# EAGLE design YAKS2-TITUO.R03.1bl (EAGLE 9.2.0)
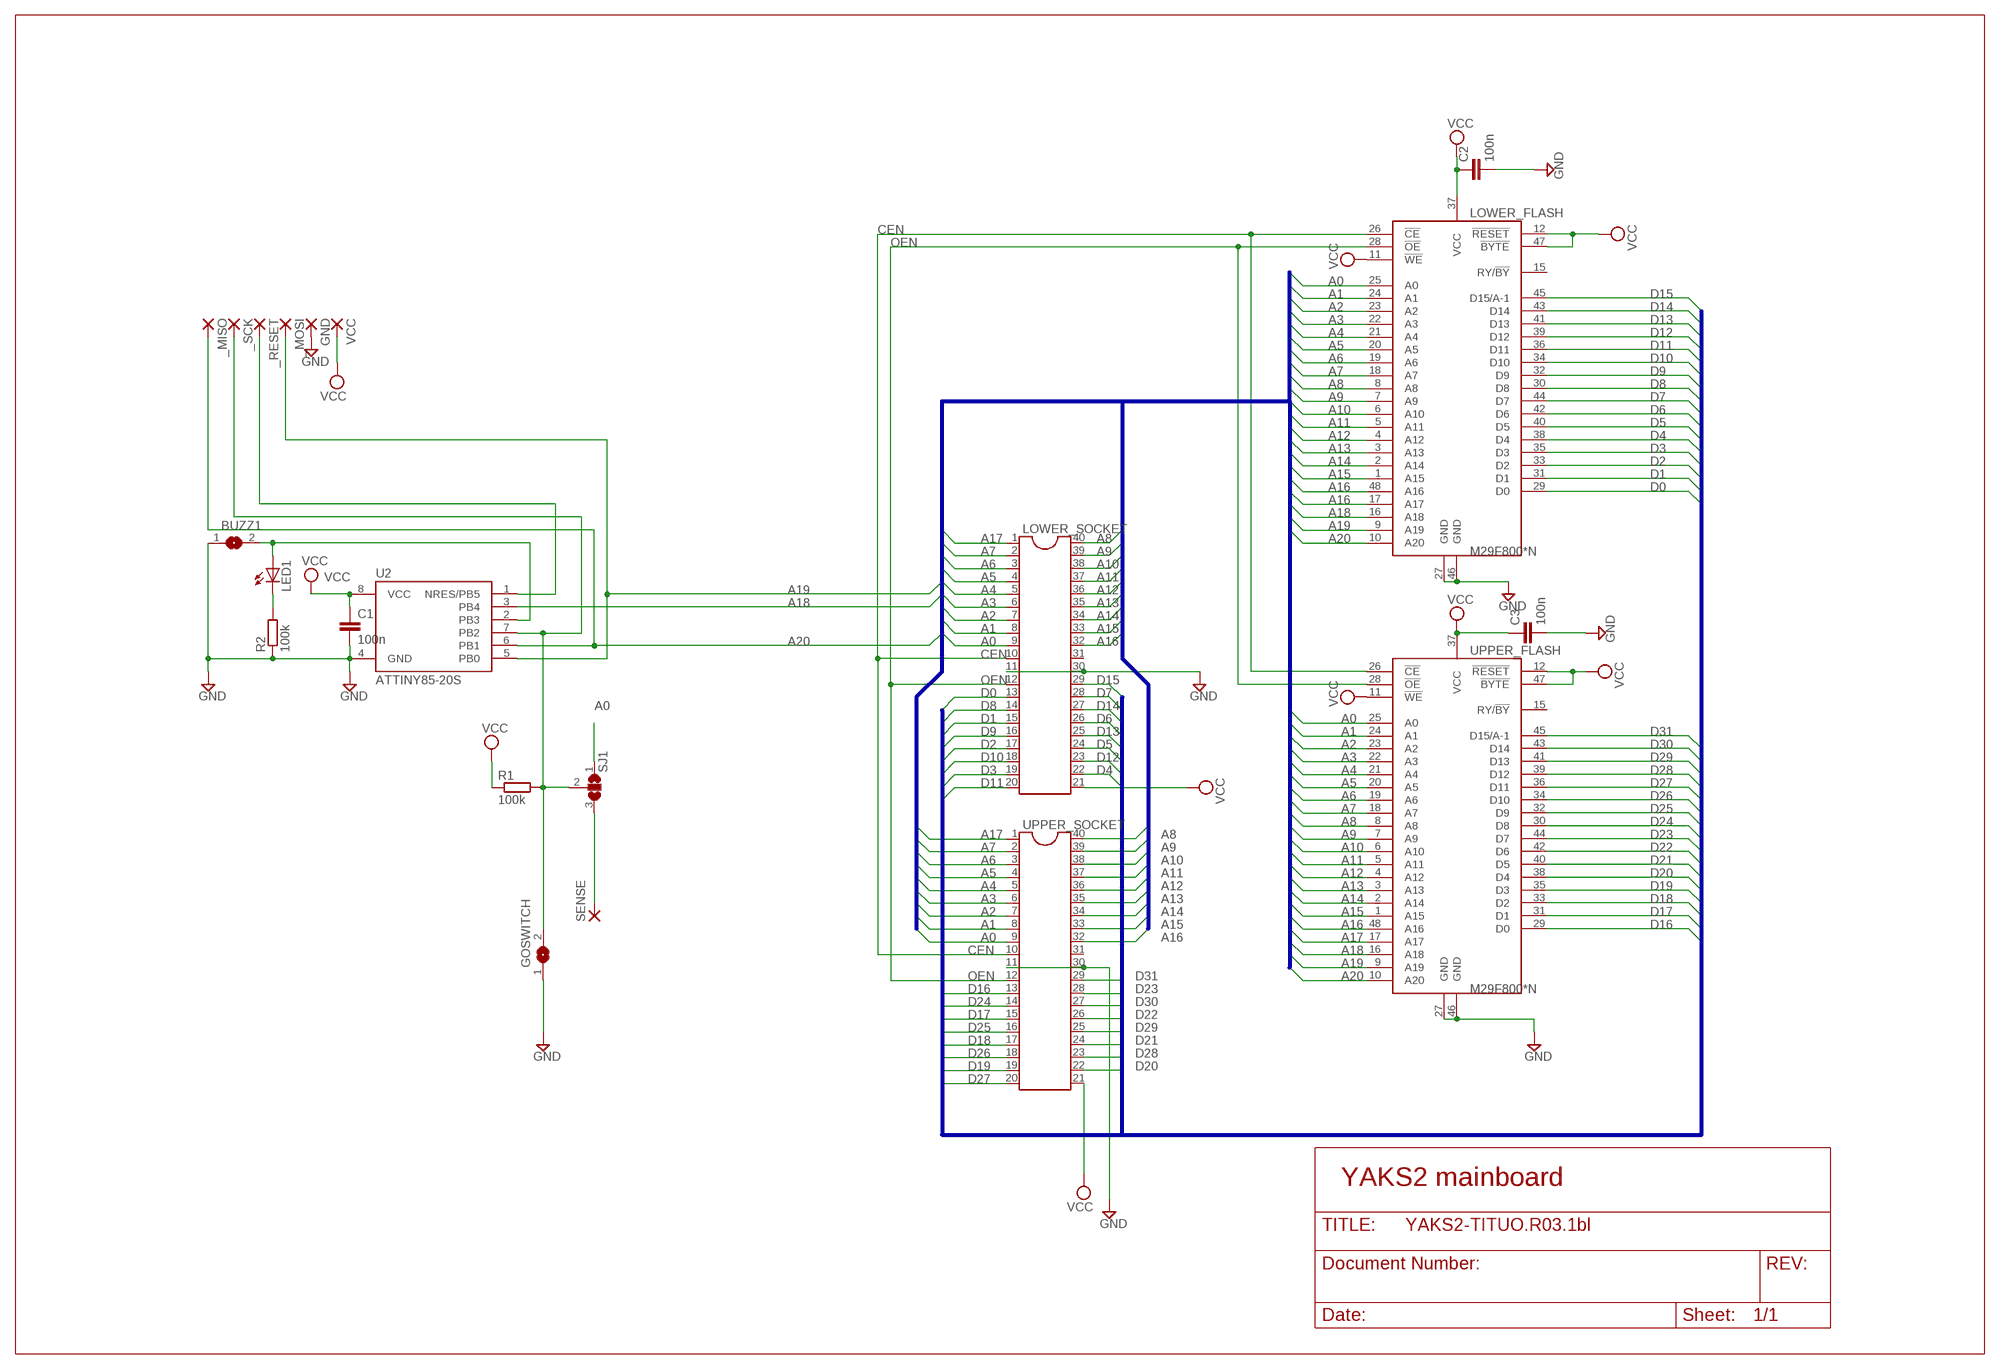
[diagram p0: schematic, sheet 1]

## Parts
_MISO  SMD2  [SMD1,27-2,54]
_MOSI  SMD2  [SMD1,27-2,54]
_RESET  SMD2  [SMD1,27-2,54]
_SCK  SMD2  [SMD1,27-2,54]
BUZZ1  SJ  [SJ]
C1  100n  C-EUC0805  [C0805]
C2  100n  C-EUC0805  [C0805]
C3  100n  C-EUC0805  [C0805]
GND  SMD2  [SMD1,27-2,54]
GOSWITCH  SJ  [SJ]
LED1  LEDSML0805  [SML0805]
LOWER_FLASH  M29F800*N  [48-TSOP]
LOWER_SOCKET  DIL40DIL40SMALLPIN  [DIL40SMALLPIN]
R1  100k  R-EU_M0805  [M0805]
R2  100k  R-EU_M0805  [M0805]
SENSE  SMD2  [SMD1,27-2,54]
SJ1  SJ2W  [SJ_2]
U2  ATTINY85-20S  [SOIC8_EIAJ_208MIL]
UPPER_FLASH  M29F800*N  [48-TSOP]
UPPER_SOCKET  DIL40DIL40SMALLPIN  [DIL40SMALLPIN]
VCC  SMD2  [SMD1,27-2,54]

## Nets
A0: LOWER_FLASH.25(A0) LOWER_SOCKET.9 SJ1.1 UPPER_FLASH.25(A0) UPPER_SOCKET.9
A1: LOWER_FLASH.24(A1) LOWER_SOCKET.8 UPPER_FLASH.24(A1) UPPER_SOCKET.8
A2: LOWER_FLASH.23(A2) LOWER_SOCKET.7 UPPER_FLASH.23(A2) UPPER_SOCKET.7
A3: LOWER_FLASH.22(A3) LOWER_SOCKET.6 UPPER_FLASH.22(A3) UPPER_SOCKET.6
A4: LOWER_FLASH.21(A4) LOWER_SOCKET.5 UPPER_FLASH.21(A4) UPPER_SOCKET.5
A5: LOWER_FLASH.20(A5) LOWER_SOCKET.4 UPPER_FLASH.20(A5) UPPER_SOCKET.4
A6: LOWER_FLASH.19(A6) LOWER_SOCKET.3 UPPER_FLASH.19(A6) UPPER_SOCKET.3
A7: LOWER_FLASH.18(A7) LOWER_SOCKET.2 UPPER_FLASH.18(A7) UPPER_SOCKET.2
A8: LOWER_FLASH.8(A8) LOWER_SOCKET.40 UPPER_FLASH.8(A8) UPPER_SOCKET.40
A9: LOWER_FLASH.7(A9) LOWER_SOCKET.39 UPPER_FLASH.7(A9) UPPER_SOCKET.39
A10: LOWER_FLASH.6(A10) LOWER_SOCKET.38 UPPER_FLASH.6(A10) UPPER_SOCKET.38
A11: LOWER_FLASH.5(A11) LOWER_SOCKET.37 UPPER_FLASH.5(A11) UPPER_SOCKET.37
A12: LOWER_FLASH.4(A12) LOWER_SOCKET.36 UPPER_FLASH.4(A12) UPPER_SOCKET.36
A13: LOWER_FLASH.3(A13) LOWER_SOCKET.35 UPPER_FLASH.3(A13) UPPER_SOCKET.35
A14: LOWER_FLASH.2(A14) LOWER_SOCKET.34 UPPER_FLASH.2(A14) UPPER_SOCKET.34
A15: LOWER_FLASH.1(A15) LOWER_SOCKET.33 UPPER_FLASH.1(A15) UPPER_SOCKET.33
A16: LOWER_FLASH.48(A16) LOWER_SOCKET.32 UPPER_FLASH.48(A16) UPPER_SOCKET.32
A17: LOWER_FLASH.17(A17) LOWER_SOCKET.1 UPPER_FLASH.17(A17) UPPER_SOCKET.1
A18: LOWER_FLASH.16(A18) U2.3(PB4) UPPER_FLASH.16(A18)
A19: _MOSI.1(P) LOWER_FLASH.9(A19) U2.5(PB0) UPPER_FLASH.9(A19)
A20: _MISO.1(P) LOWER_FLASH.10(A20) U2.6(PB1) UPPER_FLASH.10(A20)
BUZZ1: BUZZ1.2 LED1.A U2.2(PB3)
CEN: LOWER_FLASH.26(!CE) LOWER_SOCKET.10 UPPER_FLASH.26(!CE) UPPER_SOCKET.10
D0: LOWER_FLASH.29(D0) LOWER_SOCKET.13
D1: LOWER_FLASH.31(D1) LOWER_SOCKET.15
D2: LOWER_FLASH.33(D2) LOWER_SOCKET.17
D3: LOWER_FLASH.35(D3) LOWER_SOCKET.19
D4: LOWER_FLASH.38(D4) LOWER_SOCKET.22
D5: LOWER_FLASH.40(D5) LOWER_SOCKET.24
D6: LOWER_FLASH.42(D6) LOWER_SOCKET.26
D7: LOWER_FLASH.44(D7) LOWER_SOCKET.28
D8: LOWER_FLASH.30(D8) LOWER_SOCKET.14
D9: LOWER_FLASH.32(D9) LOWER_SOCKET.16
D10: LOWER_FLASH.34(D10) LOWER_SOCKET.18
D11: LOWER_FLASH.36(D11) LOWER_SOCKET.20
D12: LOWER_FLASH.39(D12) LOWER_SOCKET.23
D13: LOWER_FLASH.41(D13) LOWER_SOCKET.25
D14: LOWER_FLASH.43(D14) LOWER_SOCKET.27
D15: LOWER_FLASH.45(D15/A-1) LOWER_SOCKET.29
D16: UPPER_FLASH.29(D0) UPPER_SOCKET.13
D17: UPPER_FLASH.31(D1) UPPER_SOCKET.15
D18: UPPER_FLASH.33(D2) UPPER_SOCKET.17
D19: UPPER_FLASH.35(D3) UPPER_SOCKET.19
D20: UPPER_FLASH.38(D4) UPPER_SOCKET.22
D21: UPPER_FLASH.40(D5) UPPER_SOCKET.24
D22: UPPER_FLASH.42(D6) UPPER_SOCKET.26
D23: UPPER_FLASH.44(D7) UPPER_SOCKET.28
D24: UPPER_FLASH.30(D8) UPPER_SOCKET.14
D25: UPPER_FLASH.32(D9) UPPER_SOCKET.16
D26: UPPER_FLASH.34(D10) UPPER_SOCKET.18
D27: UPPER_FLASH.36(D11) UPPER_SOCKET.20
D28: UPPER_FLASH.39(D12) UPPER_SOCKET.23
D29: UPPER_FLASH.41(D13) UPPER_SOCKET.25
D30: UPPER_FLASH.43(D14) UPPER_SOCKET.27
D31: UPPER_FLASH.45(D15/A-1) UPPER_SOCKET.29
GND: BUZZ1.1 C1.2 C2.2 C3.2 GND.1(P) GOSWITCH.1 LOWER_FLASH.27(GND) LOWER_FLASH.46(GND) LOWER_SOCKET.11 LOWER_SOCKET.30 R2.1 U2.4(GND) UPPER_FLASH.27(GND) UPPER_FLASH.46(GND) UPPER_SOCKET.11 UPPER_SOCKET.30
N$1: LED1.C R2.2
N$4: _RESET.1(P) U2.1(NRES/PB5)
N$8: SENSE.1(P) SJ1.3
OEN: LOWER_FLASH.28(!OE) LOWER_SOCKET.12 UPPER_FLASH.28(!OE) UPPER_SOCKET.12
SCK/PB2: _SCK.1(P) GOSWITCH.2 R1.2 SJ1.2 U2.7(PB2)
VCC: C1.1 C2.1 C3.1 LOWER_FLASH.11(!WE) LOWER_FLASH.12(!RESET) LOWER_FLASH.37(VCC) LOWER_FLASH.47(!BYTE) LOWER_SOCKET.21 R1.1 U2.8(VCC) UPPER_FLASH.11(!WE) UPPER_FLASH.12(!RESET) UPPER_FLASH.37(VCC) UPPER_FLASH.47(!BYTE) UPPER_SOCKET.21 VCC.1(P)
Unconnected: LOWER_FLASH.15(RY/!BY) LOWER_SOCKET.31 UPPER_FLASH.15(RY/!BY) UPPER_SOCKET.31

## Buses
A[0..20]
D[0..31]

## Notes on the sheet
- YAKS2 mainboard

## Library data of the parts
_MISO _MOSI _RESET _SCK GND SENSE VCC = wirepad:SMD2: SMD PAD
BUZZ1 GOSWITCH = jumper:SJ: SMD solder JUMPER
C1-C3 = resistor:C-EU: CAPACITOR, European symbol
LED1 = led:LED: LED OSRAM: - CHIPLED LG R971, LG N971, LY N971, LG Q971, LY Q971, LO R971, LY R971 LH N974, LH R974 LS Q976, LO Q976, LY Q976 LO Q996 - Hyper CHIPLED LW Q18S LB Q993, LB Q99A, LB R99A - SideLED LS A670, LO A670, LY A670, LG A670, LP A670 LB A673, LV A673, LT A673, LW A673 LH A674 LY A675 LS A676, LA A676, LO A676, LY A676, LW A676 LS A679, LY A679, LG A679 - Hyper Micro SIDELED® LS Y876, LA Y876, LO Y876, LY Y876 LT Y87S - SmartLED LW L88C, LW L88S LB L89C, LB L89S, LG L890 LS L89K, LO L89K, LY L89K LS L896, LA L896, LO L896, LY L896 - TOPLED LS T670, LO T670, LY T670, LG T670, LP T670 LSG T670, LSP T670, LSY T670, LOP T670, LYG T670 LG T671, LOG T671, LSG T671 LB T673, LV T673, LT T673, LW T673 LH T674 LS T676, LA T676, LO T676, LY T676, LB T676, LH T676, LSB T676, LW T676 LB T67C, LV T67C, LT T67C, LS T67K, LO T67K, LY T67K, LW E67C LS E67B, LA E67B, LO E67B, LY E67B, LB E67C, LV E67C, LT E67C LW T67C LS T679, LY T679, LG T679 LS T770, LO T770, LY T770, LG T770, LP T770 LB T773, LV T773, LT T773, LW T773 LH T774 LS E675, LA E675, LY E675, LS T675 LS T776, LA T776, LO T776, LY T776, LB T776 LHGB T686 LT T68C, LB T68C - Hyper Mini TOPLED® LB M676 - Mini TOPLED Santana® LG M470 LS M47K, LO M47K, LY M47K Source: http://www.osram.convergy.de LUXEON: - LUMILED® LXK2-PW12-R00, LXK2-PW12-S00, LXK2-PW14-U00, LXK2-PW14-V00 LXK2-PM12-R00, LXK2-PM12-S00, LXK2-PM14-U00 LXK2-PE12-Q00, LXK2-PE12-R00, LXK2-PE12-S00, LXK2-PE14-T00, LXK2-PE14-U00 LXK2-PB12-K00, LXK2-PB12-L00, LXK2-PB12-M00, LXK2-PB14-N00, LXK2-PB14-P00, LXK2-PB14-Q00 LXK2-PR12-L00, LXK2-PR12-M00, LXK2-PR14-Q00, LXK2-PR14-R00 LXK2-PD12-Q00, LXK2-PD12-R00, LXK2-PD12-S00 LXK2-PH12-R00, LXK2-PH12-S00 LXK2-PL12-P00, LXK2-PL12-Q00, LXK2-PL12-R00 Source: www.luxeon.com KINGBRIGHT: KA-3528ASYC Source: www.kingbright.com
LOWER_FLASH UPPER_FLASH = snes_cart:M29F800: 8MBit 5V Flash ROM (1M x 8/512K x 16) Manufactured by Micron
LOWER_SOCKET UPPER_SOCKET = ic-package:DIL40: Dual In Line
R1 R2 = resistor:R-EU_: RESISTOR, European symbol
SJ1 = jumper:SJ2W: SMD solder JUMPER
U2 = _hhn_attiny25_45_85:ATTINY85*: ATMEL ATtiny 85 Packages: P = PDIP 08 30mil S = SOIC 08 EIAJ 208mil Technologies Note: for complete ordering code (temp. range, finish, tape&reel etc.) see www.atmel.com • Supply Voltage: V = (1.8…5.5)V | [blank] = (2.7…5.5)V • Speed: 10 = 10 MHz | 20 = 20 MHz Author: Dipl.-Ing. FH Rainer Bayer HHN Hochschule Heilbronn (Heilbronn University), rainer.bayer@hs-heilbronn.de Ingenieurbüro ing-rb, mail@ing-rb.de

## Board
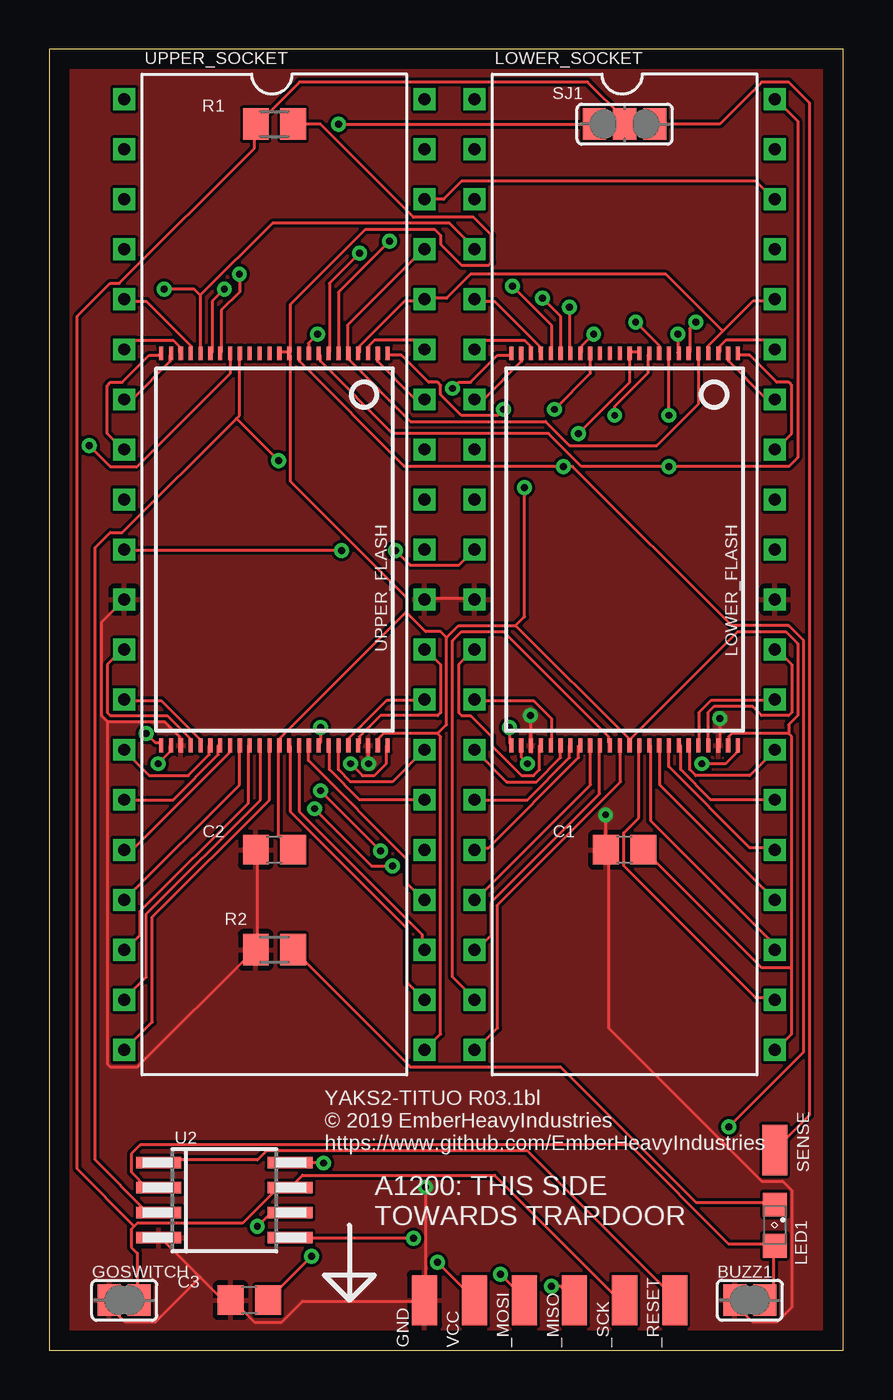
[diagram p1: board, top side]
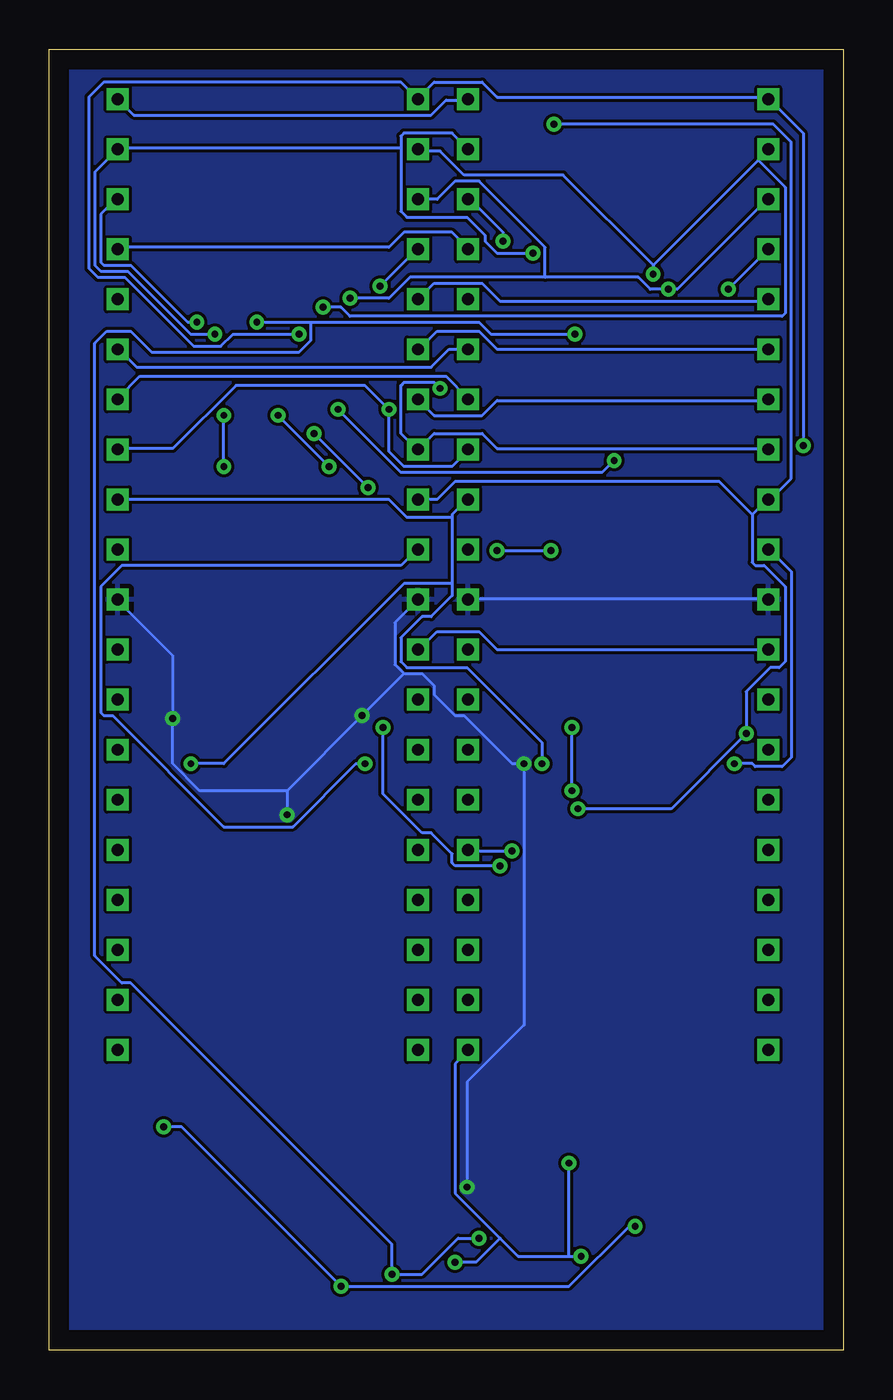
[diagram p2: board, bottom side, seen from below]

Size 40.31 x 66.03 mm. Coordinates in mm from the lower left corner, seen from the top.
Outline: 0,0 40.31,0 40.31,66.03 0,66.03 0,0
Copper layers (1*16): Top 0.035mm / dielectric 1.5mm / Bottom 0.035mm
Design rules "default": minimum track width 6mil, minimum drill 0.35mm, track to track 6mil, track to pad 6mil, pad to pad 6mil, via to via 6mil, smd to smd 6mil, copper to edge 40mil, drill to drill 6mil, minimum pad ring 10mil, minimum via ring 8mil, stop-mask expansion 4mil, vias tented up to drill 0mil, thermal gap 10mil

### Footprints (pad centres in the part's own frame; a part is rotated, then mirrored left to right if it is on the bottom)
SMD1,27-2,54 = smd 1.27 x 2.54: 1 0,0
SJ = smd 1.168 x 1.6: 1 -0.762,0; 2 0.762,0
C0805 = smd 1.3 x 1.5: 1 -0.95,0; 2 0.95,0
SML0805 = smd 1.2 x 1.2: A 1.05,0; C -1.05,0
48-TSOP = smd 0.7 x 0.21: 1 -9.95,5.75; 2 -9.95,5.25; 3 -9.95,4.75; 4 -9.95,4.25; 5 -9.95,3.75; 6 -9.95,3.25; 7 -9.95,2.75; 8 -9.95,2.25; 9 -9.95,1.75; 10 -9.95,1.25; 11 -9.95,0.75; 12 -9.95,0.25; 13 -9.95,-0.25; 14 -9.95,-0.75; 15 -9.95,-1.25; 16 -9.95,-1.75; 17 -9.95,-2.25; 18 -9.95,-2.75; 19 -9.95,-3.25; 20 -9.95,-3.75; 21 -9.95,-4.25; 22 -9.95,-4.75; 23 -9.95,-5.25; 24 -9.95,-5.75; 25 9.95,-5.75; 26 9.95,-5.25; 27 9.95,-4.75; 28 9.95,-4.25; 29 9.95,-3.75; 30 9.95,-3.25; 31 9.95,-2.75; 32 9.95,-2.25; 33 9.95,-1.75; 34 9.95,-1.25; 35 9.95,-0.75; 36 9.95,-0.25; 37 9.95,0.25; 38 9.95,0.75; 39 9.95,1.25; 40 9.95,1.75; 41 9.95,2.25; 42 9.95,2.75; 43 9.95,3.25; 44 9.95,3.75; 45 9.95,4.25; 46 9.95,4.75; 47 9.95,5.25; 48 9.95,5.75
DIL40SMALLPIN = drill 0.6 square: 1 -22.86,-7.62; 2 -20.32,-7.62; 3 -17.78,-7.62; 4 -15.24,-7.62; 5 -12.7,-7.62; 6 -10.16,-7.62; 7 -7.62,-7.62; 8 -5.08,-7.62; 9 -2.54,-7.62; 10 0,-7.62; 11 2.54,-7.62; 12 5.08,-7.62; 13 7.62,-7.62; 14 10.16,-7.62; 15 12.7,-7.62; 16 15.24,-7.62; 17 17.78,-7.62; 18 20.32,-7.62; 19 22.86,-7.62; 20 25.4,-7.62; 21 25.4,7.62; 22 22.86,7.62; 23 20.32,7.62; 24 17.78,7.62; 25 15.24,7.62; 26 12.7,7.62; 27 10.16,7.62; 28 7.62,7.62; 29 5.08,7.62; 30 2.54,7.62; 31 0,7.62; 32 -2.54,7.62; 33 -5.08,7.62; 34 -7.62,7.62; 35 -10.16,7.62; 36 -12.7,7.62; 37 -15.24,7.62; 38 -17.78,7.62; 39 -20.32,7.62; 40 -22.86,7.62
M0805 = smd 1.3 x 1.6: 1 -0.95,0; 2 0.95,0
SJ_2 = smd 1.168 x 1.6: 1 -1.524,0; 2 0,0; 3 1.524,0
SOIC8_EIAJ_208MIL = smd 0.6 x 2.286: 1 -1.905,-3.33; 2 -0.635,-3.33; 3 0.635,-3.33; 4 1.905,-3.33; 5 1.905,3.33; 6 0.635,3.33; 7 -0.635,3.33; 8 -1.905,3.33

### Placement (x,y rotation side)
_MISO  26.67,2.54 0 top
_MOSI  24.13,2.54 0 top
_RESET  31.75,2.54 0 top
_SCK  29.21,2.54 0 top
BUZZ1  35.56,2.54 0 top
C1  29.21,25.4 180 top
C2  11.43,25.4 180 top
C3  10.16,2.54 180 top
GND  19.05,2.54 0 top
GOSWITCH  3.81,2.54 0 top
LED1  36.83,6.35 270 top
LOWER_FLASH  29.21,40.64 270 top
LOWER_SOCKET  29.21,40.64 270 top
R1  11.43,62.23 180 top
R2  11.43,20.32 0 top
SENSE  36.83,10.16 0 top
SJ1  29.21,62.23 0 top
U2  8.89,7.62 270 top
UPPER_FLASH  11.43,40.64 270 top
UPPER_SOCKET  11.43,40.64 270 top
VCC  21.59,2.54 0 top

### Tracks (layer width: path | path; a pad name or v marks a point on that pad's centre or on a via)
A0  (via drill 0.35)
  Top 0.152: v4.93,31.29 5.38,30.84 5.69,30.84 UPPER_FLASH.25 | v23.37,31.6 23.37,30.84 LOWER_FLASH.25 | v17.42,24.59 16.36,24.59 v13.46,27.48 | v14.68,62.23 SJ1.1
  Bottom 0.152: 4.62,42.42 4.62,39.98 4.47,39.83 4.01,39.83 2.95,38.76 2.95,34.95 3.25,34.65 3.71,34.65 4.93,33.43 v4.93,31.29 8.74,27.48 v13.46,27.48 | 4.62,42.42 3.86,43.18 UPPER_SOCKET.9 3.71,43.18 2.64,44.25 2.64,61.32 3.56,62.23 v14.68,62.23 | v23.37,31.6 23.37,28.25 21.39,26.26 20.93,26.26 19.86,25.2 19.86,24.74 19.71,24.59 v17.42,24.59 | LOWER_SOCKET.9 20.62,43.18 19.71,44.09 6.3,44.09 4.62,42.42
A1  (via drill 0.35)
  Top 0.152: UPPER_FLASH.24 5.69,50.5 5.08,50.5 3.71,49.12 3.1,49.12 2.95,48.97 2.95,46.53 3.71,45.77 UPPER_SOCKET.8 | v20.47,48.82 20.78,49.12 21.39,49.12 22.76,50.5 23.37,50.5 LOWER_FLASH.24
  Bottom 0.152: v20.47,48.82 20.78,49.12 22.3,49.12 22.45,48.97 22.45,46.53 21.69,45.77 LOWER_SOCKET.8 20.78,46.53 18.34,46.53 17.58,45.77 3.86,45.77 UPPER_SOCKET.8
A2
  Top 0.152: UPPER_FLASH.23 6.15,50.5 6.15,50.19 4.32,48.36 3.86,48.36 UPPER_SOCKET.7 | LOWER_FLASH.23 23.98,50.5 23.98,50.19 22.15,48.36 21.69,48.36 LOWER_SOCKET.7
  Bottom 0.152: LOWER_SOCKET.7 20.78,47.45 18.34,47.45 17.58,48.21 3.86,48.21 UPPER_SOCKET.7
A3
  Top 0.152: UPPER_FLASH.22 6.6,50.65 6.6,50.95 6.3,51.26 4.32,51.26 3.86,50.8 UPPER_SOCKET.6 | LOWER_FLASH.22 24.43,50.65 24.43,50.95 24.13,51.26 22.15,51.26 21.69,50.8 LOWER_SOCKET.6
  Bottom 0.152: UPPER_SOCKET.6 17.58,50.8 18.49,51.71 20.62,51.71 21.54,50.8 LOWER_SOCKET.6
A4
  Top 0.152: UPPER_FLASH.21 7.21,50.65 7.21,50.95 4.93,53.24 3.86,53.24 UPPER_SOCKET.5 | LOWER_FLASH.21 24.89,50.65 24.89,50.95 22.61,53.24 21.69,53.24 LOWER_SOCKET.5
  Bottom 0.152: LOWER_SOCKET.5 20.78,54.15 18.34,54.15 17.42,53.24 3.86,53.24 UPPER_SOCKET.5
A5  (via drill 0.35)
  Top 0.152: 7.67,53.54 7.67,50.65 UPPER_FLASH.20 | 7.67,53.54 11.33,57.2 20.32,57.2 21.54,55.98 LOWER_SOCKET.4 | v23.52,54 25.5,52.02 25.5,50.65 LOWER_FLASH.20 | v5.84,53.85 7.37,53.85 7.67,53.54
  Bottom 0.152: v23.52,54 21.69,55.83 LOWER_SOCKET.4 | v5.84,53.85 UPPER_SOCKET.4
A6  (via drill 0.35)
  Top 0.152: v8.89,53.85 8.28,53.24 8.28,50.65 UPPER_FLASH.19 | v25.04,53.39 25.96,52.48 25.96,50.65 LOWER_FLASH.19
  Bottom 0.152: UPPER_SOCKET.3 3.86,58.42 8.43,53.85 v8.89,53.85 9.8,53.85 10.41,54.46 15.14,54.46 | v25.04,53.39 23.06,53.39 22,54.46 15.14,54.46 | LOWER_SOCKET.3 20.62,58.42 19.71,59.33 18.49,59.33 15.14,55.98 15.14,54.46
A7  (via drill 0.35)
  Top 0.152: v9.65,54.61 9.65,53.7 8.74,52.78 8.74,50.65 UPPER_FLASH.18 | v26.42,52.93 26.42,50.65 LOWER_FLASH.18
  Bottom 0.152: 9.65,55.07 v9.65,54.61 | 4.32,60.4 3.86,60.86 UPPER_SOCKET.2 | 4.32,60.4 9.65,55.07 | v26.42,52.93 25.5,52.93 25.04,52.48 3.1,52.48 2.95,52.63 2.95,59.03 4.32,60.4 | 9.65,55.07 14.22,59.64 19.25,59.64 20.47,60.86 21.54,60.86 LOWER_SOCKET.2
A8  (via drill 0.35)
  Top 0.152: UPPER_FLASH.8 13.77,50.5 13.77,50.19 17.42,46.53 25.35,46.53 27.03,44.86 v31.45,44.86 37.54,44.86 38,45.31 38,62.38 36.93,63.45 LOWER_SOCKET.40 | v31.45,47.45 31.45,50.5 LOWER_FLASH.8
  Bottom 0.152: v31.45,44.86 v31.45,47.45 | LOWER_SOCKET.40 36.02,62.69 20.93,62.69 20.17,63.45 19.1,63.45 UPPER_SOCKET.40
A9  (via drill 0.35)
  Top 0.152: v31.9,51.56 31.9,50.65 LOWER_FLASH.7 | v15.75,55.68 14.22,54.15 14.22,50.65 UPPER_FLASH.7
  Bottom 0.152: v31.9,51.56 33.12,51.56 36.32,54.76 37.69,54.76 38,55.07 38,59.79 LOWER_SOCKET.39 36.78,61.01 22.45,61.01 | v15.75,55.68 17.58,55.68 18.19,56.29 18.19,56.59 19.1,57.51 22.15,57.51 22.45,57.81 22.45,61.01 | 22.45,61.01 22.45,61.62 22.3,61.77 19.86,61.77 UPPER_SOCKET.39
A10  (via drill 0.35)
  Top 0.152: v17.27,56.29 14.68,53.7 14.68,50.65 UPPER_FLASH.6 | v32.82,52.17 32.51,51.87 32.51,50.65 LOWER_FLASH.6 | UPPER_SOCKET.38 20.02,58.42 20.93,59.33 35.87,59.33 36.78,58.42 LOWER_SOCKET.38
  Bottom 0.152: v17.27,56.29 17.27,56.74 18.95,58.42 UPPER_SOCKET.38 | v32.82,52.17 33.27,52.17 36.17,55.07 37.54,55.07 37.69,55.22 37.69,57.66 36.93,58.42 LOWER_SOCKET.38
A11
  Top 0.152: UPPER_SOCKET.37 18.95,55.83 15.14,52.02 15.14,50.65 UPPER_FLASH.5 15.14,50.5 15.14,50.34 18.34,47.14 25.2,47.14 26.42,45.92 30.84,45.92 32.97,48.06 32.97,50.5 LOWER_FLASH.5
  Bottom 0.152: LOWER_SOCKET.37 36.78,55.98 23.06,55.98 22.3,56.74 19.86,56.74 19.1,55.98 UPPER_SOCKET.37
A12
  Top 0.152: UPPER_FLASH.4 15.75,50.65 15.75,50.95 18.03,53.24 18.95,53.24 UPPER_SOCKET.36 19.1,53.39 20.17,53.39 21.39,54.61 31.29,54.61 34.19,51.71 | 34.19,51.71 35.71,53.24 36.78,53.24 LOWER_SOCKET.36 | 34.19,51.71 33.43,50.95 33.43,50.65 LOWER_FLASH.4
A13
  Top 0.152: UPPER_FLASH.3 16.21,50.65 16.21,50.95 16.51,51.26 18.49,51.26 18.95,50.8 UPPER_SOCKET.35 | LOWER_FLASH.3 34.04,50.65 34.04,50.95 34.34,51.26 36.32,51.26 36.78,50.8 LOWER_SOCKET.35
  Bottom 0.152: UPPER_SOCKET.35 20.02,50.8 20.93,49.89 35.87,49.89 36.78,50.8 LOWER_SOCKET.35
A14
  Top 0.152: UPPER_FLASH.2 16.66,50.5 16.66,50.19 18.49,48.36 18.95,48.36 UPPER_SOCKET.34 | LOWER_FLASH.2 34.49,50.5 34.49,50.19 36.32,48.36 36.78,48.36 LOWER_SOCKET.34
  Bottom 0.152: UPPER_SOCKET.34 19.1,48.36 20.17,49.43 35.71,49.43 36.78,48.36 LOWER_SOCKET.34
A15  (via drill 0.35)
  Top 0.152: LOWER_FLASH.1 34.95,50.5 35.56,50.5 36.93,49.12 37.54,49.12 37.69,48.97 37.69,46.53 36.93,45.77 LOWER_SOCKET.33 | v23.06,47.75 22.76,47.45 20.93,47.45 19.86,48.51 19.86,48.97 19.71,49.12 19.25,49.12 17.88,50.5 17.27,50.5 UPPER_FLASH.1
  Bottom 0.152: UPPER_SOCKET.33 19.1,45.62 19.86,44.86 22.3,44.86 23.06,45.62 v23.06,47.75 24.28,48.97 30.84,48.97 34.04,45.77 36.78,45.77 LOWER_SOCKET.33
A16  (via drill 0.35)
  Top 0.152: v15.29,29.77 15.9,29.16 16.51,29.16 17.12,29.77 17.12,30.68 UPPER_FLASH.48 | v33.12,29.77 34.34,29.77 34.95,30.38 LOWER_FLASH.48
  Bottom 0.152: v15.29,29.77 15.29,30.84 19.1,34.65 22.15,34.65 22.45,34.95 22.45,36.17 21.39,37.24 20.93,37.24 19.86,38.3 19.86,38.91 | 19.86,42.27 19.86,42.42 19.1,43.18 UPPER_SOCKET.32 | 19.86,42.27 19.86,38.91 | v33.12,29.77 31.45,29.77 22.3,38.91 19.86,38.91 | LOWER_SOCKET.32 23.06,43.18 22.15,42.27 19.86,42.27
A17  (via drill 0.35)
  Top 0.152: v2.03,45.92 3.1,44.86 4.47,44.86 9.2,49.58 9.2,50.5 UPPER_FLASH.17 | v27.63,51.56 27.03,50.95 27.03,50.65 LOWER_FLASH.17
  Bottom 0.152: v2.03,45.92 2.03,61.77 3.71,63.45 UPPER_SOCKET.1 3.86,63.6 17.58,63.6 18.34,64.36 20.78,64.36 21.54,63.6 LOWER_SOCKET.1 22.45,64.36 37.54,64.36 38.3,63.6 38.3,54.92 37.85,54.46 36.47,54.46 32.97,50.95 31.6,50.95 30.99,51.56 v27.63,51.56
A18  (via drill 0.35)
  Top 0.152: 9.5,47.3 3.71,41.5 3.1,41.5 2.34,40.74 2.34,9.65 4.93,7.06 5.54,7.06 U2.3 | 9.5,47.3 9.65,47.45 9.65,50.5 UPPER_FLASH.16 | v25.65,47.75 27.48,49.58 27.48,50.5 LOWER_FLASH.16 | 9.5,47.3 v11.63,45.16
  Bottom 0.152: v25.65,47.75 22.45,44.55 12.24,44.55 v11.63,45.16
A19  (via drill 0.35)
  Top 0.152: v13.61,51.56 13.16,51.11 13.16,50.65 UPPER_FLASH.9 | v29.77,52.17 30.99,50.95 30.99,50.65 LOWER_FLASH.9 | v18.49,5.69 12.24,5.69 U2.5 | v22.91,3.86 24.13,2.64 _MOSI.1
  Bottom 0.152: v13.61,51.56 17.88,51.56 18.49,52.17 27.03,52.17 | v29.77,52.17 27.03,52.17 | v18.49,5.69 19.56,5.69 21.39,3.86 v22.91,3.86 22.91,5.38 36.17,18.64 36.63,18.64 38,20.02 38,51.11 37.39,51.71 36.17,51.71 35.1,50.65 27.63,50.65 27.03,51.26 27.03,52.17
A20  (via drill 0.35)
  Top 0.152: v28.7,47.45 28.7,47.9 30.38,49.58 30.38,50.5 LOWER_FLASH.10 | UPPER_FLASH.10 12.7,50.5 12.7,50.19 18.03,44.86 v26.11,44.86 26.57,44.86 34.65,36.78 37.54,36.78 38.3,36.02 38.3,15.14 v34.49,11.33 | v10.57,6.3 11.18,6.91 12.09,6.91 U2.6 | v25.5,3.25 25.96,3.25 _MISO.1
  Bottom 0.152: v28.7,47.45 v26.11,44.86 | v10.57,6.3 10.87,6.3 13.92,3.25 v25.5,3.25 33.58,11.33 v34.49,11.33
BUZZ1
  Top 0.152: BUZZ1.2 36.32,2.64 36.78,3.1 36.78,5.23 LED1.A 36.78,5.38 34.49,5.38 29.46,10.41 4.62,10.41 4.17,9.96 4.17,9.04 4.93,8.28 5.54,8.28 U2.2
CEN  (via drill 0.35)
  Top 0.152: v5.54,29.77 6.15,30.38 6.15,30.68 UPPER_FLASH.26 | v24.28,29.77 23.98,30.07 23.98,30.68 LOWER_FLASH.26 | v14.83,40.59 3.86,40.59 UPPER_SOCKET.10 | v17.58,40.59 18.34,39.83 20.78,39.83 LOWER_SOCKET.10
  Bottom 0.152: v5.54,29.77 4.62,29.77 4.47,29.62 3.1,29.62 2.64,30.07 2.64,39.52 3.71,40.59 UPPER_SOCKET.10 | v24.28,29.77 24.74,29.77 27.94,26.57 31.45,26.57 37.08,32.21 37.54,32.21 37.69,32.36 37.69,38.76 36.63,39.83 22.45,39.83 21.69,40.59 LOWER_SOCKET.10 | v17.58,40.59 v14.83,40.59
D0
  Top 0.152: LOWER_FLASH.29 25.5,30.84 25.5,32.05 24.59,32.97 21.69,32.97 LOWER_SOCKET.13
D1
  Top 0.152: LOWER_SOCKET.15 24.28,27.94 26.42,30.07 26.42,30.68 LOWER_FLASH.31
D2
  Top 0.152: LOWER_FLASH.33 27.48,30.68 27.48,28.7 21.69,22.91 LOWER_SOCKET.17
D3
  Top 0.152: LOWER_FLASH.35 28.4,30.84 28.4,31.14 23.06,36.47 20.93,36.47 20.47,36.02 20.47,18.95 21.54,17.88 LOWER_SOCKET.19
D4
  Top 0.152: LOWER_FLASH.38 29.92,30.68 29.92,27.03 29.16,26.26 29.16,24.59 35.87,17.88 36.78,17.88 LOWER_SOCKET.22
D5
  Top 0.152: LOWER_SOCKET.24 30.99,28.7 30.99,30.68 LOWER_FLASH.40
D6
  Top 0.152: LOWER_SOCKET.26 33.58,27.94 32.05,29.46 32.05,30.68 LOWER_FLASH.42
D7
  Top 0.152: LOWER_FLASH.44 32.97,30.84 32.97,32.36 33.58,32.97 36.78,32.97 LOWER_SOCKET.28
D8
  Top 0.152: LOWER_SOCKET.14 23.22,28.85 24.74,28.85 25.96,30.07 LOWER_FLASH.30
D9
  Top 0.152: LOWER_FLASH.32 26.87,30.68 26.87,30.07 22.3,25.5 21.69,25.5 LOWER_SOCKET.16
D10
  Top 0.152: LOWER_FLASH.34 27.94,30.68 27.94,28.25 22.45,22.76 22.45,21.08 21.69,20.32 LOWER_SOCKET.18
D11
  Top 0.152: LOWER_FLASH.36 29.01,30.68 29.01,28.85 22.76,22.61 22.76,16.36 21.69,15.29 LOWER_SOCKET.20
D12
  Top 0.152: LOWER_FLASH.39 30.53,30.68 30.53,26.87 36.78,20.62 36.78,20.32 LOWER_SOCKET.23
D13
  Top 0.152: LOWER_FLASH.41 31.45,30.68 31.45,29.62 35.56,25.5 36.78,25.5 LOWER_SOCKET.25
D14
  Top 0.152: LOWER_FLASH.43 32.51,30.68 32.51,29.46 32.82,29.16 35.56,29.16 36.78,30.38 LOWER_SOCKET.27
D15
  Top 0.152: LOWER_FLASH.45 33.43,30.84 33.43,32.36 33.73,32.66 35.71,32.66 36.17,32.21 37.54,32.21 37.69,32.36 37.69,34.8 36.93,35.56 LOWER_SOCKET.29
D16
  Top 0.152: UPPER_FLASH.29 7.67,30.84 7.67,30.99 5.69,32.97 3.86,32.97 UPPER_SOCKET.13
D17
  Top 0.152: UPPER_SOCKET.15 6.3,27.94 8.59,30.23 8.59,30.68 UPPER_FLASH.31
D18
  Top 0.152: UPPER_SOCKET.17 9.65,28.7 9.65,30.68 UPPER_FLASH.33
D19
  Top 0.152: UPPER_FLASH.35 10.72,30.68 10.72,27.94 4.93,22.15 4.93,18.95 3.86,17.88 UPPER_SOCKET.19
D20
  Top 0.152: UPPER_SOCKET.22 18.19,18.64 18.19,21.39 12.24,27.33 12.24,30.68 UPPER_FLASH.38
D21
  Top 0.152: UPPER_FLASH.40 13.16,30.68 13.16,29.92 18.19,24.89 18.19,23.67 18.95,22.91 UPPER_SOCKET.24
D22
  Top 0.152: UPPER_SOCKET.26 15.75,27.94 14.22,29.46 14.22,30.68 UPPER_FLASH.42
D23
  Top 0.152: UPPER_FLASH.44 15.14,30.84 15.14,30.99 17.12,32.97 18.95,32.97 UPPER_SOCKET.28
D24
  Top 0.152: UPPER_FLASH.30 8.13,30.68 8.13,30.23 7.06,29.16 5.08,29.16 3.86,30.38 UPPER_SOCKET.14
D25
  Top 0.152: UPPER_FLASH.32 9.2,30.68 9.2,30.38 4.32,25.5 3.86,25.5 UPPER_SOCKET.16
D26
  Top 0.152: UPPER_FLASH.34 10.11,30.68 10.11,27.79 4.62,22.3 4.62,21.08 3.86,20.32 UPPER_SOCKET.18
D27
  Top 0.152: UPPER_SOCKET.20 5.23,16.66 5.23,22 11.18,27.94 UPPER_FLASH.36
D28
  Top 0.152: UPPER_FLASH.39 12.7,30.68 12.7,27.33 18.95,21.08 18.95,20.32 UPPER_SOCKET.23
D29  (via drill 0.35)
  Top 0.152: v13.77,31.6 13.77,30.84 UPPER_FLASH.41 | v16.82,25.35 v13.77,28.4
  Bottom 0.152: v13.77,28.4 v13.77,31.6 | v16.82,25.35 18.95,25.35 UPPER_SOCKET.25
D30
  Top 0.152: UPPER_SOCKET.27 17.42,28.85 15.29,28.85 14.68,29.46 UPPER_FLASH.43
D31
  Top 0.152: UPPER_FLASH.45 15.75,30.84 15.75,31.14 16.82,32.21 19.71,32.21 19.86,32.36 19.86,34.8 19.1,35.56 UPPER_SOCKET.29
GND  (via drill 0.35)
  Top 0.152: C2.2 10.57,25.35 10.57,20.32 R2.1 10.41,20.32 4.47,14.38 3.1,14.38 2.95,14.53 2.95,31.9 | 2.95,31.9 5.84,31.9 6.6,31.14 6.6,30.84 UPPER_FLASH.27 | 2.95,31.9 2.64,32.21 2.64,36.93 UPPER_SOCKET.11 | 7.67,3.71 5.69,5.69 U2.4 | 7.67,3.71 8.74,2.64 9.2,2.64 C3.2 9.35,2.49 10.41,1.42 11.79,1.42 12.85,2.49 18.95,2.49 GND.1 19.1,2.64 v19.1,8.28 | 7.67,3.71 5.38,1.42 3.86,1.42 3.1,2.18 3.1,2.49 GOSWITCH.1 | v34.04,32.05 34.04,30.84 LOWER_FLASH.46 | v16.21,29.77 16.21,30.68 UPPER_FLASH.46 | v24.43,32.21 24.43,30.84 LOWER_FLASH.27 | v28.25,27.18 28.25,25.5 C1.2 28.4,25.35 28.4,16.36 36.17,8.58 37.24,8.58 37.69,8.13 37.69,2.18 36.93,1.42 35.71,1.42 35.41,1.73 35.41,1.88 34.8,2.49 BUZZ1.1 | UPPER_SOCKET.30 19.1,38.15 21.54,38.15 LOWER_SOCKET.11
  Bottom 0.152: LOWER_SOCKET.30 36.78,38 34.04,35.26 v34.04,32.05 34.04,29.77 32.66,28.4 28.25,28.4 | 22.3,34.34 21.39,34.34 20.78,33.73 20.78,33.27 19.71,32.21 19.25,32.21 16.82,29.77 v16.21,29.77 16.21,16.51 19.1,13.61 v19.1,8.28 | 22.3,34.34 22.76,34.8 22.76,36.93 LOWER_SOCKET.11 | 22.3,34.34 v24.43,32.21 28.25,28.4 | 28.25,28.4 v28.25,27.18 | UPPER_SOCKET.11 3.86,38.15 18.95,38.15 UPPER_SOCKET.30
  pour Top: 0,66.04 40.64,66.04 40.64,0 0,0
  pour Bottom: 0,66.04 40.64,66.04 40.64,0 0,0
N$1
  Top 0.152: LED1.C 36.78,7.52 32.82,7.52 25.96,14.38 18.34,14.38 12.39,20.32 R2.2
N$4
  Top 0.152: U2.1 5.69,9.65 10.57,9.65 11.02,10.11 24.28,10.11 31.75,2.64 _RESET.1
N$8
  Top 0.152: SJ1.3 34.04,62.23 36.17,64.36 37.54,64.36 38.61,63.3 38.61,11.94 SENSE.1
OEN
  Top 0.152: UPPER_FLASH.28 7.21,30.84 7.21,30.99 5.99,32.21 3.1,32.21 2.95,32.36 2.95,34.8 3.71,35.56 UPPER_SOCKET.12 | LOWER_FLASH.28 24.89,30.68 24.89,29.46 24.59,29.16 23.98,29.16 22.45,30.68 22.45,31.14 21.39,32.21 20.93,32.21 20.78,32.36 20.78,34.8 21.54,35.56 LOWER_SOCKET.12
  Bottom 0.152: UPPER_SOCKET.12 17.58,35.56 18.49,36.47 20.62,36.47 21.54,35.56 LOWER_SOCKET.12
SCK/PB2
  Top 0.152: SJ1.2 29.16,62.23 29.16,62.53 27.33,64.36 12.7,64.36 10.57,62.23 R1.2 10.41,62.23 10.41,61.01 3.56,54.15 3.1,54.15 1.42,52.48 1.42,9.19 4.32,6.3 | 4.32,6.3 4.47,6.45 9.8,6.45 11.48,8.13 12.09,8.13 U2.7 12.24,8.28 12.85,8.89 22.61,8.89 28.85,2.64 29.16,2.64 _SCK.1 | 4.32,6.3 4.17,6.15 4.17,5.23 4.47,4.93 4.47,2.64 GOSWITCH.2
VCC  (via drill 0.35)
  Top 0.152: 37.54,31.29 34.65,31.29 34.49,31.14 34.49,30.84 LOWER_FLASH.47 | 37.54,31.29 37.69,31.14 37.69,19.41 | 37.69,19.41 37.69,16.05 36.93,15.29 LOWER_SOCKET.21 | 37.69,19.41 36.17,19.41 30.23,25.35 C1.1 | C2.1 12.24,25.5 11.63,26.11 11.63,30.68 UPPER_FLASH.37 11.63,30.84 11.63,30.99 18.19,37.54 | LOWER_FLASH.11 29.92,50.65 29.46,50.65 LOWER_FLASH.12 29.46,50.5 29.46,49.12 v26.87,46.53 | UPPER_FLASH.12 11.63,50.65 12.09,50.65 UPPER_FLASH.11 | 19.71,31.29 16.97,31.29 16.66,30.99 16.66,30.84 UPPER_FLASH.47 | 19.71,31.29 19.86,31.14 19.86,16.05 UPPER_SOCKET.21 | 29.46,30.99 29.46,30.84 LOWER_FLASH.37 29.46,30.99 | 23.67,36.78 29.46,30.99 | 23.67,36.78 20.78,36.78 20.17,36.17 | 20.17,36.17 20.17,31.75 19.71,31.29 | 18.19,37.54 18.19,37.39 19.1,36.47 19.86,36.47 20.17,36.17 | 18.19,37.54 18.19,38.15 12.24,44.09 12.24,50.5 UPPER_FLASH.11 | v24.13,43.79 24.13,37.24 23.67,36.78 | v13.31,4.78 11.18,2.64 C3.1 | R1.1 13.77,62.23 18.49,57.51 21.54,57.51 22.45,56.59 22.45,55.22 22.3,55.07 20.93,55.07 19.86,56.13 19.86,56.59 19.56,56.9 16.05,56.9 12.24,53.09 12.24,50.65 UPPER_FLASH.11 | v13.92,9.5 12.24,9.5 U2.8 | v19.71,4.47 21.54,2.64 VCC.1 | 37.54,31.29 37.54,31.75 38,32.21 38,35.87 37.39,36.47 34.95,36.47 29.46,30.99
  Bottom 0.152: v24.13,43.79 v26.87,46.53 | 13.92,4.78 16.51,4.78 17.42,5.69 | 13.92,4.78 v13.31,4.78 | 17.42,5.69 19.71,7.98 19.71,14.53 19.1,15.14 UPPER_SOCKET.21 | 13.92,4.78 v13.92,9.5 | v19.71,4.47 18.64,4.47 17.42,5.69

### Text on the board
tPlace: YAKS2-TITUO R03.1bl / © 2019 EmberHeavyIndustries / https://www.github.com/EmberHeavyIndustries | A1200: THIS SIDE / TOWARDS TRAPDOOR